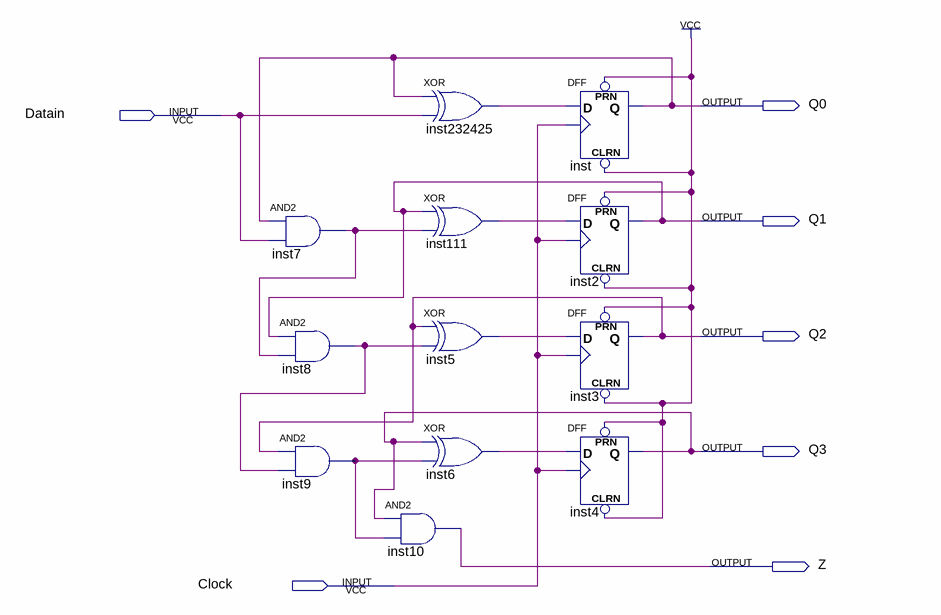
[diagram p0: schematic sheet]
// Quartus schematic lab10step2a.bdf as structural Verilog: 12 symbols, 7 pins
module lab10step2a (
  input  Datain,
  input  Clock,
  output Q0,
  output Q1,
  output Q2,
  output Q3,
  output Z
);

  wire inst5_out, inst6_out, inst7_out, inst8_out, inst9_out, inst111_out, inst232425_out;

  and inst7 (inst7_out, Q0, Datain);
  and inst8 (inst8_out, Q1, inst7_out);
  and inst9 (inst9_out, Q2, inst8_out);
  and inst10 (Z, Q3, inst9_out);
  xor inst232425 (inst232425_out, Q0, Datain);
  xor inst111 (inst111_out, Q1, inst7_out);
  xor inst5 (inst5_out, Q2, inst8_out);
  xor inst6 (inst6_out, Q3, inst9_out);
  DFF inst (.CLRN(1'b1), .CLK(Clock), .D(inst232425_out), .PRN(1'b1), .Q(Q0));
  DFF inst2 (.CLRN(1'b1), .CLK(Clock), .D(inst111_out), .PRN(1'b1), .Q(Q1));
  DFF inst3 (.CLRN(1'b1), .CLK(Clock), .D(inst5_out), .PRN(1'b1), .Q(Q2));
  DFF inst4 (.CLRN(1'b1), .CLK(Clock), .D(inst6_out), .PRN(1'b1), .Q(Q3));
endmodule
